# Altium schematic sheet [12] USB3.0_Connector1&2.SchDoc
size A3; DocumentNumber: 12; SheetNumber: 12; SheetTotal: 16
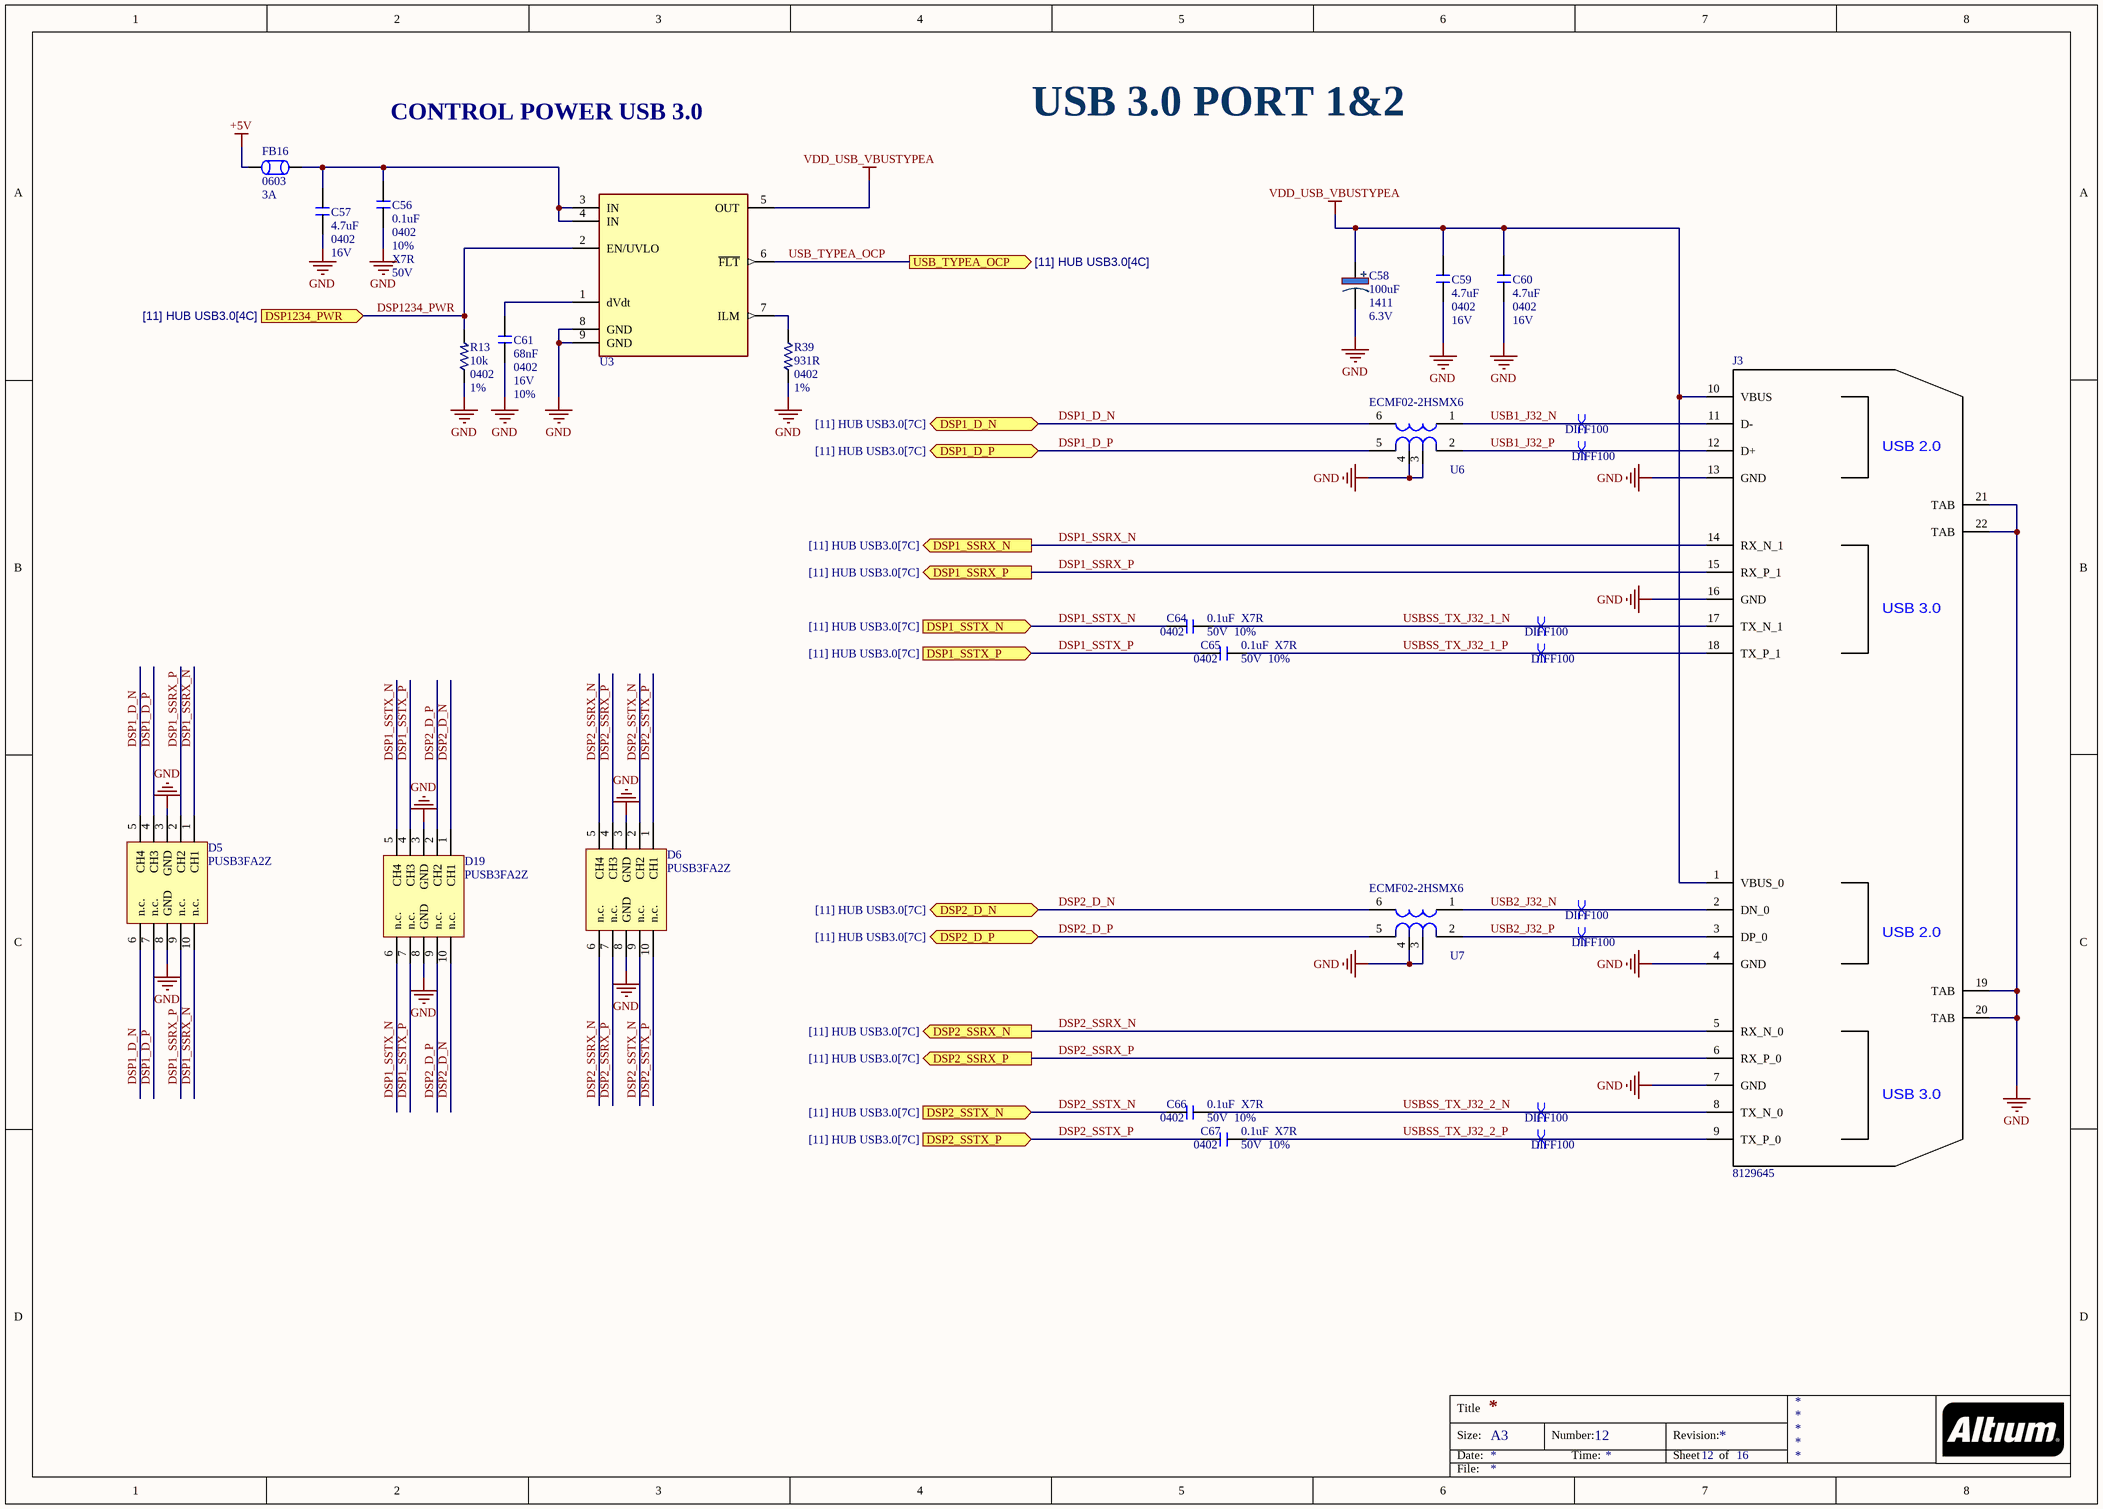
[diagram p0: [12] USB3.0_Connector1&2.SchDoc]

## Parts
C56  0.1uF  Case/Package: 0402  Tolerance: 10%  Dielectric: X7R  Voltage: 50V  [C0402M]
C57  4.7uF  Case/Package: 0402  Voltage Rating: 16V  [C0402M]
C58  100uF  Case/Package: 1411  Voltage Rating: 6.3V  [CP_TANT_3528]
C59  4.7uF  Case/Package: 0402  Voltage Rating: 16V  [C0402M]
C60  4.7uF  Case/Package: 0402  Voltage Rating: 16V  [C0402M]
C61  68nF  Case/Package: 0402  Voltage Rating: 16V  Tolerance: 10%  [C0402M]
C64  0.1uF  Case/Package: 0402  Tolerance: 10%  Dielectric: X7R  Voltage: 50V  [C0402M]
C65  0.1uF  Case/Package: 0402  Tolerance: 10%  Dielectric: X7R  Voltage: 50V  [C0402M]
C66  0.1uF  Case/Package: 0402  Tolerance: 10%  Dielectric: X7R  Voltage: 50V  [C0402M]
C67  0.1uF  Case/Package: 0402  Tolerance: 10%  Dielectric: X7R  Voltage: 50V  [C0402M]
D5  PUSB3FA2Z  [SON50P100X50-10N]
D6  PUSB3FA2Z  [SON50P100X50-10N]
D19  PUSB3FA2Z  [SON50P100X50-10N]
FB16  Case/Package: 0603  Max DC Current: 3A  [R0603M]  (hidden comment: FB)
J3  Supplier Part Number 1: 8129645  [Molex_48406-0003_0]  (hidden comment: 48406-0003)
R13  10k  Case Code (Imperial): 0402  Tolerance: 1%  [R0402M]
R39  931R  Case Code (Imperial): 0402  Tolerance: 1%  [R0402M]
U3  TPS259530DSGT  [TPS259530DSGT]  (value not drawn)
U6  ECMF02-2HSMX6  [SON50P150X55-6N]
U7  ECMF02-2HSMX6  [SON50P150X55-6N]

## Ports
DSP1_D_N (bidir, see [11] HUB USB3.0[7C]), DSP1_D_P (bidir, see [11] HUB USB3.0[7C]), DSP1_SSRX_N (out, see [11] HUB USB3.0[7C]), DSP1_SSRX_P (out, see [11] HUB USB3.0[7C]), DSP1_SSTX_N (in, see [11] HUB USB3.0[7C]), DSP1_SSTX_P (in, see [11] HUB USB3.0[7C]), DSP2_D_N (bidir, see [11] HUB USB3.0[7C]), DSP2_D_P (bidir, see [11] HUB USB3.0[7C]), DSP2_SSRX_N (out, see [11] HUB USB3.0[7C]), DSP2_SSRX_P (out, see [11] HUB USB3.0[7C]), DSP2_SSTX_N (in, see [11] HUB USB3.0[7C]), DSP2_SSTX_P (in, see [11] HUB USB3.0[7C]), DSP1234_PWR (in, see [11] HUB USB3.0[4C]), USB_TYPEA_OCP (out, see [11] HUB USB3.0[4C])

## Nets
+5V: FB16.2
GND: C56.1 C57.2 C58.2 C59.2 C60.2 C61.1 D5.3(GND) D5.8(GND) D6.3(GND) D6.8(GND) D19.3(GND) D19.8(GND) J3.4(GND) J3.7(GND) J3.13(GND) J3.16(GND) J3.19(TAB) J3.20(TAB) J3.21(TAB) J3.22(TAB) R13.2 R39.1 U3.8(GND) U3.9(GND) U6.3 U6.4 U7.3 U7.4
VDD_USB_VBUSTYPEA: C58.1 C59.1 C60.1 J3.1(VBUS_0) J3.10(VBUS) U3.5(OUT)
DSP1_D_N: D5.5(CH4) D5.6(n.c.) U6.6 ; port DSP1_D_N
DSP1_D_P: D5.4(CH3) D5.7(n.c.) U6.5 ; port DSP1_D_P
DSP1_SSRX_N: D5.1(CH1) D5.10(n.c.) J3.14(RX_N_1) ; port DSP1_SSRX_N
DSP1_SSRX_P: D5.2(CH2) D5.9(n.c.) J3.15(RX_P_1) ; port DSP1_SSRX_P
DSP1_SSTX_N: C64.1 D19.5(CH4) D19.6(n.c.) ; port DSP1_SSTX_N
DSP1_SSTX_P: C65.1 D19.4(CH3) D19.7(n.c.) ; port DSP1_SSTX_P
DSP2_D_N: D19.1(CH1) D19.10(n.c.) U7.6 ; port DSP2_D_N
DSP2_D_P: D19.2(CH2) D19.9(n.c.) U7.5 ; port DSP2_D_P
DSP2_SSRX_N: D6.5(CH4) D6.6(n.c.) J3.5(RX_N_0) ; port DSP2_SSRX_N
DSP2_SSRX_P: D6.4(CH3) D6.7(n.c.) J3.6(RX_P_0) ; port DSP2_SSRX_P
DSP2_SSTX_N: C66.1 D6.2(CH2) D6.9(n.c.) ; port DSP2_SSTX_N
DSP2_SSTX_P: C67.1 D6.1(CH1) D6.10(n.c.) ; port DSP2_SSTX_P
DSP1234_PWR: R13.1 U3.2(EN/UVLO) ; port DSP1234_PWR
USB1_J32_N: J3.11(D-) U6.1
USB1_J32_P: J3.12(D+) U6.2
USB2_J32_N: J3.2(DN_0) U7.1
USB2_J32_P: J3.3(DP_0) U7.2
USB_TYPEA_OCP: U3.6(~{FLT}) ; port USB_TYPEA_OCP
USBSS_TX_J32_1_N: C64.2 J3.17(TX_N_1)
USBSS_TX_J32_1_P: C65.2 J3.18(TX_P_1)
USBSS_TX_J32_2_N: C66.2 J3.8(TX_N_0)
USBSS_TX_J32_2_P: C67.2 J3.9(TX_P_0)
NetC56_2: C56.2 C57.1 FB16.1 U3.3(IN) U3.4(IN)
NetC61_2: C61.2 U3.1(dVdt)
NetR39_2: R39.2 U3.7(ILM)

## Layout directives
differential pair; differential pair class DIFF100; net class DIFF100: USB1_J32_N, USB1_J32_P, USB2_J32_N, USB2_J32_P, USBSS_TX_J32_1_N, USBSS_TX_J32_1_P, USBSS_TX_J32_2_N, USBSS_TX_J32_2_P

## Notes on the sheet
- CONTROL POWER USB 3.0
- USB 3.0 PORT 1&2
- Title
- Size:
- Date:
- A3
- Number:
- Time:
- Revision:
- Sheet
- of
- File:
- (in symbol 48406-0003) USB 2.0; USB 3.0

## Library data of the parts
C56 C64-C67 = CAP_CER: CAP CER 0.1UF 50V X7R 0402; Manufacturer: Murata; Manufacturer Part Number: GRM155R71H104KE14D; Material: Ceramic; Capacitance: 100nF; Dissipation Factor: 0.025%; ComponentLink1URL: https://datasheet.ciiva.com/25741/cl10b104kb8nnnl-25741341.pdf?src-supplier=Digi-Key; ComponentLink1Description: https://datasheet.ciiva.com/25741/cl10b104kb8nnnl-25741341.pdf?src-supplier=Digi-Key; ComponentLink2URL: https://datasheet.ciiva.com/26838/getdatasheetpartid-357523-26838415.pdf?src-supplier=Verical; ComponentLink2Description: https://datasheet.ciiva.com/26838/getdatasheetpartid-357523-26838415.pdf?src-supplier=Verical; Supplier 1: Digi-Key; Supplier Part Number 1: 490-10700-1-ND; Stock 1: 2282266; Pricing 1: 1 = 0.10000, 10 = 0.04600, 100 = 0.02050, 500 = 0.01464, 1000 = 0.01150, 2500 = 0.01045, 5000 = 0.00961 (USD); RoHS: Yes; Mount: Surface Mount; Weight: 0.000212oz; Case Code (Metric): 1005; Case Code (Imperial): 0402; Dielectric Material: Ceramic; Min Operating Temperature: -55°C; Max Operating Temperature: 125°C; Packaging: Tape and Reel; Voltage Rating: 50V; Termination: SMD/SMT; Composition: Ceramic; Voltage Rating (DC): 50V; Package Quantity: 10000; Length: 1mm; Height: 0.5mm; Width: 0.5mm; Thickness: 0.022inch; Depth: 0.5mm; REACH SVHC: No SVHC; Lead Free: Lead Free; ComponentLink3URL: http://www.farnell.com/datasheets/2079156.pdf?src-supplier=Farnell; ComponentLink3Description: http://www.farnell.com/datasheets/2079156.pdf?src-supplier=Farnell; ComponentLink4URL: http://www.mouser.com/ds/2/281/c02e-2905.pdf?src-supplier=Mouser; ComponentLink4Description: http://www.mouser.com/ds/2/281/c02e-2905.pdf?src-supplier=Mouser; ComponentLink5URL: http://components.arrow.com/part/dataview/0323_07030614?src-supplier=Arrow+Europe; ComponentLink5Description: http://components.arrow.com/part/dataview/0323_07030614?src-supplier=Arrow+Europe; ComponentLink6URL: https://search.murata.co.jp/Ceramy/image/img/A01X/G101/ENG/GRM155R71H104KE14-01.pdf?src-supplier=Digi-Key; ComponentLink6Description: https://search.murata.co.jp/Ceramy/image/img/A01X/G101/ENG/GRM155R71H104KE14-01.pdf?src-supplier=Digi-Key; ComponentLink7URL: http://psearch.en.murata.com/capacitor/product/GRM155R71H104KE14%23.pdf?src-supplier=Avnet; ComponentLink7Description: http://psearch.en.murata.com/capacitor/product/GRM155R71H104KE14%23.pdf?src-supplier=Avnet; ComponentLink8URL: http://www.farnell.com/datasheets/2079156.pdf?src-supplier=Element14; ComponentLink8Description: http://www.farnell.com/datasheets/2079156.pdf?src-supplier=Element14; ComponentLink9URL: http://www.farnell.com/datasheets/2079156.pdf?src-supplier=Newark; ComponentLink9Description: http://www.farnell.com/datasheets/2079156.pdf?src-supplier=Newark
C57 C59 C60 = CAP_CER: CAP CER 4.7UF 16V X5R 0402; Manufacturer: Samsung; Manufacturer Part Number: CL05A475MO5NUNC; Tolerance: 20%; ComponentLink1URL: https://datasheet.ciiva.com/25786/cl05a475mp5nrnc-25786963.pdf?src-supplier=Digi-Key; ComponentLink1Description: https://datasheet.ciiva.com/25786/cl05a475mp5nrnc-25786963.pdf?src-supplier=Digi-Key; ComponentLink2URL: https://datasheet.ciiva.com/16437/cl05b104kq5nnnc-16437353.pdf?src-supplier=Future+Electronics; ComponentLink2Description: https://datasheet.ciiva.com/16437/cl05b104kq5nnnc-16437353.pdf?src-supplier=Future+Electronics; Supplier 1: Digi-Key; Supplier Part Number 1: 1276-6836-6-ND; Stock 1: 1677309; Pricing 1: 1 = 0.45000, 10 = 0.32100, 100 = 0.21130, 500 = 0.15656, 1000 = 0.13307, 2500 = 0.12524, 5000 = 0.11741 (USD); RoHS: Yes; Mount: Surface Mount; Case Code (Imperial): 0402; Case Code (Metric): 1005; Min Operating Temperature: -55°C; Max Operating Temperature: 85°C; Packaging: Tape and Reel; Capacitance: 4.7uF; Length: 0.039inch; Width: 0.02inch; Thickness: 0.022inch; ComponentLink3URL: http://www.farnell.com/datasheets/2710653.pdf?src-supplier=Farnell; ComponentLink3Description: http://www.farnell.com/datasheets/2710653.pdf?src-supplier=Farnell; ComponentLink4URL: http://www.farnell.com/datasheets/2710653.pdf?src-supplier=Newark; ComponentLink4Description: http://www.farnell.com/datasheets/2710653.pdf?src-supplier=Newark; ComponentLink5URL: http://www.samsungsem.com/kr/support/product-search/mlcc/CL05A475MO5NUNC.jsp?src-supplier=Digi-Key; ComponentLink5Description: http://www.samsungsem.com/kr/support/product-search/mlcc/CL05A475MO5NUNC.jsp?src-supplier=Digi-Key
C58 = CAP_PL: CAP TANT 100UF 20% 6.3V 1411; Manufacturer: KEMET; Manufacturer Part Number: T495B107M006ATE700; ESR (Equivalent Series Resistance): 700mR; Polarity: Polar; Dissipation Factor: 15%; Resistance: 0.7R; Life (Hours): 2000Hour; Supplier 1: Digi-Key; Supplier Part Number 1: 399-3875-1-ND; Stock 1: 1375; Pricing 1: 1 = 1.67000, 10 = 1.31700, 50 = 1.14120, 100 = 0.98750, 500 = 0.74614, 1000 = 0.65835 (USD); RoHS: Yes; Mount: Surface Mount; Number of Pins: 2; Case Code (Metric): 3528; Case Code (Imperial): 1411; Weight: 0.002293oz; Min Operating Temperature: -55°C; Max Operating Temperature: 125°C; Capacitance: 100uF; Tolerance: 20%; Packaging: Tape and Reel; Package Quantity: 1; Termination: SMD/SMT; Voltage Rating (DC): 6.3V; Features: General Purpose; Length: 3.5mm; Width: 0.11inch; Height: 2.8mm; Depth: 2.8mm; Height - Seated (Max): 0.083inch; Radiation Hardening: No; Lead Free: Lead Free; REACH SVHC: No SVHC; ComponentLink1URL: https://datasheet.ciiva.com/22691/1744555-22691447.pdf?src-supplier=Element14; ComponentLink1Description: https://datasheet.ciiva.com/22691/1744555-22691447.pdf?src-supplier=Element14
C61 = CAP_CER: CAP .068UF 16VDC X7R 10% SMD  0402; Manufacturer 1: TDK; Manufacturer Part Number 1: CGA2B1X7R1C683K050BC; Supplier 1: Newark; Supplier Part Number 1: 52W9552; Stock 1: 10000; Pricing 1: 1=0.16000, 10=0.07700, 25=0.06300, 50=0.04800, 100=0.03400 (USD); RoHS: Yes; Mount: Surface Mount; Case Code (Metric): 1005; Case Code (Imperial): 0402; Weight: 2.3E-05oz; Min Operating Temperature: -55°C; Max Operating Temperature: 125°C; Capacitance: 68nF; Packaging: Tape and Reel; Voltage Rating (DC): 16V; Dielectric: X7R; Termination: SMD/SMT; Series: CGA; Package Quantity: 10000; Resistor Type: Ceramic; Length: 1mm; Width: 0.02inch; Height: 0.5mm; Thickness: 0.022inch; Depth: 0.5mm; Ratings: AEC-Q200; RoHS Compliant: Yes; REACH SVHC: No SVHC; ComponentLink1URL: https://datasheet.ciiva.com/24217/cga2b1x7r1c683k050bc-265779-24217530.pdf?src-supplier=Mouser; ComponentLink1Description: https://datasheet.ciiva.com/24217/cga2b1x7r1c683k050bc-265779-24217530.pdf?src-supplier=Mouser; ComponentLink2URL: https://datasheet.ciiva.com/22694/1807242-22694215.pdf?src-supplier=Element14; ComponentLink2Description: https://datasheet.ciiva.com/22694/1807242-22694215.pdf?src-supplier=Element14; ComponentLink3URL: https://datasheet.ciiva.com/7975/1807242-7975213.pdf?src-supplier=Element14; ComponentLink3Description: https://datasheet.ciiva.com/7975/1807242-7975213.pdf?src-supplier=Element14
D5 D6 D19 = PUSB3FA2Z: ESD Suppressors / TVS Diodes PUSB3FA2 XSON10; Manufacturer 1: Nexperia; Supplier 1: Digi-Key; Manufacturer Part Number 1: PUSB3FA2Z; RoHS: No; Stock 1: 355; Pricing 1: 1=0.33000, 10=0.25600, 100=0.15390, 500=0.14250, 1000=0.09690, 2000=0.08921 (USD); ComponentLink1URL: https://assets.nexperia.com/documents/data-sheet/PUSB3FA2.pdf?src-supplier=Digi-Key; ComponentLink1Description: https://assets.nexperia.com/documents/data-sheet/PUSB3FA2.pdf?src-supplier=Digi-Key; Supplier Part Number 1: 1727-7813-1-ND
FB16 = FB: MURATA - BLM18KG121TN1D - Ferrite Bead, 0603 [1608 Metric], 120 ohm, 3 A, EMIFIL BLM18K Series, 0.03 ohm, ± 25%; Material: Ferrite,Steel; Impedance: 120R; Number of Lines: 1; DC Resistance (DCR): 30mR; Test Frequency: 100MHz; Supplier 1: Newark; Supplier Part Number 1: 55R1509; Manufacturer 1: Murata; Manufacturer Part Number 1: BLM18KG121TN1D; Stock 1: 39; Pricing 1: 10=0.05200, 25=0.04600, 50=0.04100, 100=0.03500 (USD); RoHS: Yes; Number of Pins: 2; Core Material: Ferrite; Case Code (Metric): 1608; Case Code (Imperial): 0603; Min Operating Temperature: -55°C; Max Operating Temperature: 125°C; Package Quantity: 4000; Tolerance: 25%; Packaging: Tape and Reel; Current Rating: 3A; Max Current Rating: 3A; Termination: SMD/SMT; Number of Circuits: 1; Series: BLM18K; Inductor Type: FERRITE BEAD; Length: 1.6mm; Width: 0.8mm; Height: 0.8mm; Depth: 0.95mm; REACH SVHC: No SVHC; Lead Free: Lead Free; RoHS Compliant: Yes; ComponentLink1URL: https://datasheet.ciiva.com/11795/0900766b81076276-11795748.pdf?src-supplier=RSComponents; ComponentLink1Description: https://datasheet.ciiva.com/11795/0900766b81076276-11795748.pdf?src-supplier=RSComponents; ComponentLink2URL: https://datasheet.ciiva.com/1012/l0110e-1012353.pdf?src-supplier=Digi-Key; ComponentLink2Description: https://datasheet.ciiva.com/1012/l0110e-1012353.pdf?src-supplier=Digi-Key; ComponentLink3URL: https://datasheet.ciiva.com/1012/l0110e-1012354.pdf?src-supplier=Digi-Key; ComponentLink3Description: https://datasheet.ciiva.com/1012/l0110e-1012354.pdf?src-supplier=Digi-Key; ComponentLink4URL: https://datasheet.ciiva.com/1012/l0110e-1012355.pdf?src-supplier=Digi-Key; ComponentLink4Description: https://datasheet.ciiva.com/1012/l0110e-1012355.pdf?src-supplier=Digi-Key; ComponentLink5URL: https://datasheet.ciiva.com/22715/486545-22715701.pdf?src-supplier=Element14; ComponentLink5Description: https://datasheet.ciiva.com/22715/486545-22715701.pdf?src-supplier=Element14; ComponentLink6URL: https://datasheet.ciiva.com/41449/001172289-da-01-en-drossel-0603-120r-1-6x0-8mm-4000st-41449628.pdf?src-supplier=Conrad; ComponentLink6Description: https://datasheet.ciiva.com/41449/001172289-da-01-en-drossel-0603-120r-1-6x0-8mm-4000st-41449628.pdf?src-supplier=Conrad
J3 = 48406-0003: Conn USB 3.0 Type A F 18 POS 2mm/2.5mm Solder RA Thru-Hole 18 Terminal 2 Port USB 3.0 Tray; Manufacturer 1: Molex; Supplier 1: RSComponents; Manufacturer Part Number 1: 48406-0003; Stock 1: 201; Pricing 1: 1=2.79200, 50=2.48300, 100=2.24100, 250=1.96000, 500=1.89300 (USD); RoHS: Yes
R13 = RES_SMD: RES SMD 10K OHM 1% 1/16W 0402; Manufacturer: Yageo; Manufacturer Part Number: RC0402FR-0710KL; Resistance: 10kR; Temperature Coefficient: 100ppm/°C; Voltage Rating (DC): 50V; Power Rating: 62.5mW; Supplier 1: Digi-Key; Supplier Part Number 1: 311-10.0KLRTR-ND; Stock 1: 58760000; Pricing 1: 10000 = 0.001630, 30000 = 0.001440, 50000 = 0.001320, 100000 = 0.001290 (USD); RoHS: Yes; Case/Package: 0402; Number of Pins: 2; Case Code (Metric): 1005; Min Operating Temperature: -55°C; Max Operating Temperature: 155°C; Composition: Thick Film; Packaging: Tape and Reel; Voltage Rating: 50V; Termination: SMD/SMT; Military Standard: Not; Working Voltage: 50V; Number of Terminations: 2; Length: 1mm; Height: 0.32mm; Width: 0.5mm; Depth: 0.5mm; Lead Pitch: 0.2mm; REACH SVHC: No SVHC; Lead Free: Lead Free; ComponentLink1URL: https://datasheet.ciiva.com/7660/38568-7660787.pdf?src-supplier=Element14; ComponentLink1Description: https://datasheet.ciiva.com/7660/38568-7660787.pdf?src-supplier=Element14; ComponentLink2URL: https://datasheet.ciiva.com/7849/1784430-7849813.pdf?src-supplier=Element14; ComponentLink2Description: https://datasheet.ciiva.com/7849/1784430-7849813.pdf?src-supplier=Element14; ComponentLink3URL: https://datasheet.ciiva.com/7849/1686128-7849814.pdf?src-supplier=Element14; ComponentLink3Description: https://datasheet.ciiva.com/7849/1686128-7849814.pdf?src-supplier=Element14; ComponentLink4URL: https://datasheet.ciiva.com/7849/1784430-7849815.pdf?src-supplier=Element14; ComponentLink4Description: https://datasheet.ciiva.com/7849/1784430-7849815.pdf?src-supplier=Element14; ComponentLink5URL: https://datasheet.ciiva.com/22747/1018594-22747512.pdf?src-supplier=Element14; ComponentLink5Description: https://datasheet.ciiva.com/22747/1018594-22747512.pdf?src-supplier=Element14; ComponentLink6URL: https://datasheet.ciiva.com/12667/pyu-rc0402-51-rohs-l-6-r-12667067.pdf?src-supplier=Mouser; ComponentLink6Description: https://datasheet.ciiva.com/12667/pyu-rc0402-51-rohs-l-6-r-12667067.pdf?src-supplier=Mouser; ComponentLink7URL: https://datasheet.ciiva.com/7983/1018594-7983486.pdf?src-supplier=Element14; ComponentLink7Description: https://datasheet.ciiva.com/7983/1018594-7983486.pdf?src-supplier=Element14
R39 = RES_SMD: 贴片电阻 931Ω ± 1.00% 0.0625W ± 100ppm/℃ 0402; Manufacturer 1: Yageo; Manufacturer Part Number 1: RC0402FR-07931RL; Temperature Coefficient: 100ppm/°C; Voltage Rating: 50V; Power Rating: 62.5mW; Max Power Dissipation: 63mW; Supplier 1: Mouser; Supplier Part Number 1: 603-RC0402FR-07931RL; Stock 1: 913; Pricing 1: 1=0.10000, 10=0.01200, 50=0.01200, 100=0.00500, 1000=0.00300, 2500=0.00200, 10000=0.00100 (USD); RoHS: Yes; Case/Package: 0402; Contact Plating: Tin,Matte; Case Code (Metric): 1005; Size Code: 0402; Min Operating Temperature: -55°C; Max Operating Temperature: 155°C; Resistance: 931R; Resistor Type: Thick Film; Packaging: Tape and Reel; Number of Terminations: 2; Termination: SMD/SMT; Voltage Rating (DC): 50V; Features: Moisture Resistant; Series: RC; Construction: Rectangular; Length: 1mm; Width: 0.02inch; Height: 0.016inch; Depth: 0.5mm; Military Standard: Not; Lead Free: Lead Free; RoHS Compliant: Yes; ComponentLink1URL: https://datasheet.ciiva.com/16931/pyu-rc0402-51-rohs-l-6-r-16931231.pdf?src-supplier=Future+Electronics; ComponentLink1Description: https://datasheet.ciiva.com/16931/pyu-rc0402-51-rohs-l-6-r-16931231.pdf?src-supplier=Future+Electronics
U3 = TPS259530DSGT: TPS259530 12V eFuse with Fast Overvoltage Protection 2.7V to 18V 4A 34m Ohm 8-Pin WSON T/R; Manufacturer 1: Texas Instruments; Number of Channels: 1; Accuracy: 7.5%; Supplier 1: Mouser; Manufacturer Part Number 1: TPS259530DSGT; Stock 1: 0; Pricing 1: 1=1.06000, 10=0.95100, 25=0.90300, 50=0.90300, 100=0.74200, 250=0.69200, 1000=0.69200, 10000=0.69200 (USD); RoHS: Yes; Mount: Surface Mount; Min Operating Temperature: -40°C; Max Operating Temperature: 125°C; Packaging: Tape and Reel; Output Current: 4A; RoHS Compliant: Yes; ComponentLink1URL: http://www.ti.com/general/docs/suppproductinfo.tsp?distId=10&amp;gotoUrl=http%3A%2F%2Fwww.ti.com%2Flit%2Fgpn%2Ftps2595&src-supplier=Digi-Key; ComponentLink1Description: http://www.ti.com/general/docs/suppproductinfo.tsp?distId=10&amp;gotoUrl=http%3A%2F%2Fwww.ti.com%2Flit%2Fgpn%2Ftps2595&src-supplier=Digi-Key; Supplier Part Number 1: 595-TPS259530DSGT
U6 U7 = ECMF02-2AMX6: CMC 200MA 2LN SMD ESD; Manufacturer 1: STMicroelectronics; Number of Lines: 2; Max Current Rating: 100mA; DC Resistance (DCR): 9R; Frequency: 6GHz; Supplier 1: Digi-Key; Supplier Part Number 1: 497-14544-1-ND; Manufacturer Part Number 1: ECMF02-2HSMX6; Stock 1: 3; Pricing 1: 1=0.71000, 10=0.62100, 25=0.57720, 50=0.48820, 100=0.44390, 250=0.41724, 500=0.37286, 1000=0.30184 (USD); RoHS: Yes; Mount: Surface Mount; Number of Pins: 6; Min Operating Temperature: -40°C; Max Operating Temperature: 85°C; Package Quantity: 3000; Packaging: Tape and Reel; Current: 100mA; Termination: SMD/SMT; Length: 0.063inch; Width: 0.053inch; Height: 0.022inch; Radiation Hardening: No; REACH SVHC: No SVHC; Lead Free: Lead Free; RoHS Compliant: Yes; ComponentLink1URL: https://datasheet.ciiva.com/29369/dm00092023-29369570.pdf?src-supplier=Digi-Key; ComponentLink1Description: https://datasheet.ciiva.com/29369/dm00092023-29369570.pdf?src-supplier=Digi-Key; ComponentLink2URL: https://datasheet.ciiva.com/29369/dm00092023-29369574.pdf?src-supplier=Digi-Key; ComponentLink2Description: https://datasheet.ciiva.com/29369/dm00092023-29369574.pdf?src-supplier=Digi-Key; ComponentLink3URL: https://datasheet.ciiva.com/46423/1867258-46423658.pdf?src-supplier=Element14; ComponentLink3Description: https://datasheet.ciiva.com/46423/1867258-46423658.pdf?src-supplier=Element14